# Altium schematic sheet 16.40PIN CONNECT.SchDoc: CM3 IO
size 297 x 209 mm; Page Create Date: March  8, 1995; Page Number: 16; Page Size: A4; Comment: radxa_1010; Page Count: 20; RevCode: 1.36; Doc: 40PIN CONNECT; DsnPath: D:\WMS\黄工\[RC119]CM3_IO_V1.36\对外资料\radxa_cm3_io_board_v1360.DSN; SchematicName: CM3_IO V1.36; PageName: 16.40PIN CONNECT; PageSize: A4; TopSchematic: True
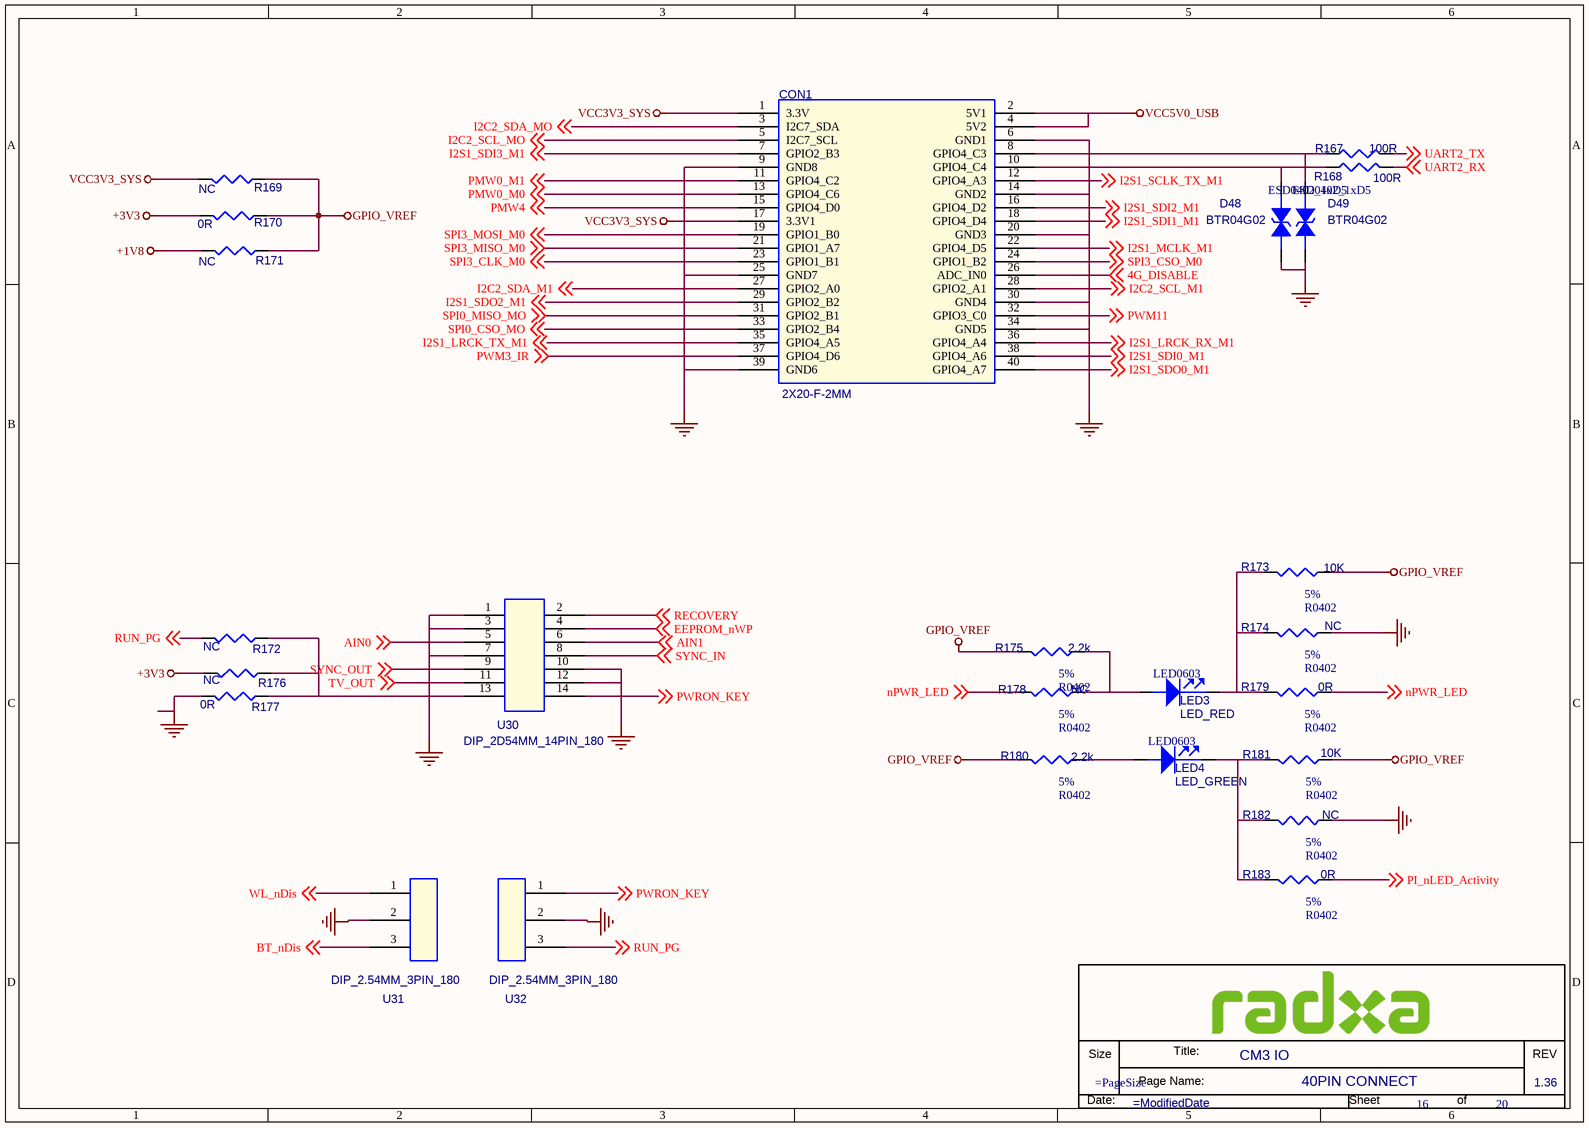
[diagram p0: 16.40PIN CONNECT.SchDoc]

## Parts
*  Doc: 40PIN CONNECT  RevCode: 1.36  Title: CM3 IO  Page Number: 16  Page Count: 20  (hidden comment: radxa_1010)  (graphical)
CON1  2X20-F-2MM  [DIP40PIN_2D54MM]
D48  BTR04G02  [ESD0402_1xD5]
D49  BTR04G02  [ESD0402_1xD5]
LED3  LED_RED  [LED0603]
LED4  LED_GREEN  [LED0603]
R167  100R  [R0402]
R168  100R  [R0402]
R169  NC  [R0603]
R170  0R  [R0603]
R171  NC  [R0603]
R172  NC  [R0402]
R173  10K  Tolerance: 5%  [R0402]
R174  NC  Tolerance: 5%  [R0402]
R175  2.2k  Tolerance: 5%  [R0402]
R176  NC  [R0402]
R177  0R  [R0402]
R178  NC  Tolerance: 5%  [R0402]
R179  0R  Tolerance: 5%  [R0402]
R180  2.2k  Tolerance: 5%  [R0402]
R181  10K  Tolerance: 5%  [R0402]
R182  NC  Tolerance: 5%  [R0402]
R183  0R  Tolerance: 5%  [R0402]
U30  DIP_2D54MM_14PIN_180  [DIP_14PIN-2_54MM]
U31  DIP_2.54MM_3PIN_180  [DIP3_1X2P54]
U32  DIP_2.54MM_3PIN_180  [DIP3_1X2P54]

## Nets
+1V8: R171.2
+3V3: R170.2 R176.2
GND: CON1.6(GND1) CON1.9(GND8) CON1.14(GND2) CON1.20(GND3) CON1.25(GND7) CON1.30(GND4) CON1.34(GND5) CON1.39(GND6) D48.1 D49.1 R174.2 R177.2 R182.2 U30.1 U30.3 U30.7 U30.10 U30.12 U31.2 U32.2
GPIO_VREF: R169.1 R170.1 R171.1 R173.2 R175.1 R180.1 R181.2
VCC3V3_SYS: CON1.1(3.3V) CON1.17(3.3V1) R169.2
VCC5V0_USB: CON1.2(5V1) CON1.4(5V2)
4G_DISABLE: CON1.26(ADC_IN0) ; off-sheet 4G_DISABLE
AIN0: U30.5 ; off-sheet AIN0
AIN1: U30.6 ; off-sheet AIN1
BT_nDis: U31.3 ; off-sheet BT_nDis
EEPROM_nWP: U30.4 ; off-sheet EEPROM_nWP
I2C2_SCL_M1: CON1.28(GPIO2_A1) ; off-sheet I2C2_SCL_M1
I2C2_SCL_MO: CON1.5(I2C7_SCL) ; off-sheet I2C2_SCL_MO
I2C2_SDA_M1: CON1.27(GPIO2_A0) ; off-sheet I2C2_SDA_M1
I2C2_SDA_MO: CON1.3(I2C7_SDA) ; off-sheet I2C2_SDA_MO
I2S1_LRCK_RX_M1: CON1.36(GPIO4_A4) ; off-sheet I2S1_LRCK_RX_M1
I2S1_LRCK_TX_M1: CON1.35(GPIO4_A5) ; off-sheet I2S1_LRCK_TX_M1
I2S1_MCLK_M1: CON1.22(GPIO4_D5) ; off-sheet I2S1_MCLK_M1
I2S1_SCLK_TX_M1: CON1.12(GPIO4_A3) ; off-sheet I2S1_SCLK_TX_M1
I2S1_SDI0_M1: CON1.38(GPIO4_A6) ; off-sheet I2S1_SDI0_M1
I2S1_SDI1_M1: CON1.18(GPIO4_D4) ; off-sheet I2S1_SDI1_M1
I2S1_SDI2_M1: CON1.16(GPIO4_D2) ; off-sheet I2S1_SDI2_M1
I2S1_SDI3_M1: CON1.7(GPIO2_B3) ; off-sheet I2S1_SDI3_M1
I2S1_SDO0_M1: CON1.40(GPIO4_A7) ; off-sheet I2S1_SDO0_M1
I2S1_SDO2_M1: CON1.29(GPIO2_B2) ; off-sheet I2S1_SDO2_M1
nPWR_LED: R178.1 R179.2 ; off-sheet nPWR_LED
PI_nLED_Activity: R183.2 ; off-sheet PI_nLED_Activity
PMW0_M0: CON1.13(GPIO4_C6) ; off-sheet PMW0_M0
PMW0_M1: CON1.11(GPIO4_C2) ; off-sheet PMW0_M1
PMW4: CON1.15(GPIO4_D0) ; off-sheet PMW4
PWM3_IR: CON1.37(GPIO4_D6) ; off-sheet PWM3_IR
PWM11: CON1.32(GPIO3_C0) ; off-sheet PWM11
PWRON_KEY: U30.14 U32.1 ; off-sheet PWRON_KEY
RECOVERY: U30.2 ; off-sheet RECOVERY
RUN_PG: R172.2 U32.3 ; off-sheet RUN_PG
SPI0_CSO_MO: CON1.33(GPIO2_B4) ; off-sheet SPI0_CSO_MO
SPI0_MISO_MO: CON1.31(GPIO2_B1) ; off-sheet SPI0_MISO_MO
SPI3_CLK_M0: CON1.23(GPIO1_B1) ; off-sheet SPI3_CLK_M0
SPI3_CSO_M0: CON1.24(GPIO1_B2) ; off-sheet SPI3_CSO_M0
SPI3_MISO_M0: CON1.21(GPIO1_A7) ; off-sheet SPI3_MISO_M0
SPI3_MOSI_M0: CON1.19(GPIO1_B0) ; off-sheet SPI3_MOSI_M0
SYNC_IN: U30.8 ; off-sheet SYNC_IN
SYNC_OUT: U30.9 ; off-sheet SYNC_OUT
TV_OUT: U30.11 ; off-sheet TV_OUT
UART2_RX: R168.2 ; off-sheet UART2_RX
UART2_TX: R167.2 ; off-sheet UART2_TX
WL_nDis: U31.1 ; off-sheet WL_nDis
NetCON1_8: CON1.8(GPIO4_C3) D49.2 R167.1
NetCON1_10: CON1.10(GPIO4_C4) D48.2 R168.1
NetLED3_1: LED3.1(ANODE) R175.2 R178.2
NetLED3_2: LED3.2(CATHODE) R173.1 R174.1 R179.1
NetLED4_1: LED4.1(ANODE) R180.2
NetLED4_2: LED4.2(CATHODE) R181.1 R182.1 R183.1
NetR172_1: R172.1 R176.1 R177.1 U30.13

## Notes on the sheet
- (in symbol radxa_1010) Size; Title:; REV; Page Name:; Date:; Sheet; of

## Library data of the parts
CON1 = CN_0: Part Reference: CON1; Value: 2X20-F-2MM; PCB Footprint: DIP40PIN_2D54MM
D48 = DIODE BI_DIR TRIG_0: 1-Line, Bi-directional, Transient Voltage Suppressors.17.5pF.; Part Reference: D48; Manufacturer PN: ESD5451N; Manufacturer: WillSemi(韦尔半导体); OPTION: DNP; Priority: A; PCB Footprint: ESD0402_1xD5; Value: BTR04G02; Created by: JJJ; Part Type: ESD_TVS; RK PN: ESD5451N
D49 = DIODE BI_DIR TRIG_0: 1-Line, Bi-directional, Transient Voltage Suppressors.17.5pF.; Part Reference: D49; Manufacturer: WillSemi(韦尔半导体); RK PN: ESD5451N; Priority: A; OPTION: DNP; PCB Footprint: ESD0402_1xD5; Value: BTR04G02; Part Type: ESD_TVS; Manufacturer PN: ESD5451N; Created by: JJJ
LED3 = LED: 贴片LED灯，0603，绿色; Part Reference: LED3; Priority: A; RK PN: LED_GREEN; PCB Footprint: LED0603; Value: LED_RED; Created by: JJJ; Part Type: LED
LED4 = LED: 贴片LED灯，0603，绿色; Part Reference: LED4; Priority: A; PCB Footprint: LED0603; Value: LED_GREEN; Created by: JJJ; Part Type: LED; RK PN: LED_GREEN
R167 = RESISTOR_0: 通用厚膜电阻,100R,+/-5%,R0402,1/16W.; Part Reference: R167; Manufacturer PN: RC0402JR-07100RL; Manufacturer: YAGEO; Wattage: 1/16W; Tolerance: 5%; Priority: A; Value: 100R; Created by: YTL; Part Type: 通用厚膜电阻; RK PN: RC0402JR-07100RL; PCB Footprint: R0402
R168 = RESISTOR_0: 通用厚膜电阻,100R,+/-5%,R0402,1/16W.; Part Reference: R168; Manufacturer: YAGEO; RK PN: RC0402JR-07100RL; Priority: A; Tolerance: 5%; Wattage: 1/16W; Value: 100R; Part Type: 通用厚膜电阻; Manufacturer PN: RC0402JR-07100RL; Created by: YTL; PCB Footprint: R0402
R169 = RESISTOR_0: 通用厚膜电阻,100R,+/-5%,R0402,1/16W.; Part Reference: R169; Manufacturer PN: RC0402JR-07100RL; Manufacturer: YAGEO; Wattage: 1/16W; Tolerance: 5%; Priority: A; Value: NC; Created by: YTL; Part Type: 通用厚膜电阻; RK PN: RC0402JR-07100RL; PCB Footprint: R0603
R170 = RESISTOR_0: 通用厚膜电阻,100R,+/-5%,R0402,1/16W.; Part Reference: R170; Manufacturer: YAGEO; RK PN: RC0402JR-07100RL; Priority: A; Tolerance: 5%; Wattage: 1/16W; Value: 0R; Part Type: 通用厚膜电阻; Manufacturer PN: RC0402JR-07100RL; Created by: YTL; PCB Footprint: R0603
R171 = RESISTOR_0: 通用厚膜电阻,100R,+/-5%,R0402,1/16W.; Part Reference: R171; Manufacturer PN: RC0402JR-07100RL; Manufacturer: YAGEO; Wattage: 1/16W; Tolerance: 5%; Priority: A; Value: NC; Created by: YTL; Part Type: 通用厚膜电阻; RK PN: RC0402JR-07100RL; PCB Footprint: R0603
R172 = RESISTOR_0: 通用厚膜电阻,100R,+/-5%,R0402,1/16W.; Part Reference: R172; Manufacturer PN: RC0402JR-07100RL; Manufacturer: YAGEO; Wattage: 1/16W; Tolerance: 5%; Priority: A; Value: NC; Created by: YTL; Part Type: 通用厚膜电阻; RK PN: RC0402JR-07100RL; PCB Footprint: R0402
R173 = RESISTOR_2: 通用厚膜电阻,330R,+/-5%,R0402,1/16W.; Part Reference: R173; Manufacturer PN: RC0402JR-07330RL; Manufacturer: YAGEO; Wattage: 1/16W; Priority: A; PCB Footprint: R0402; Value: 10K; Created by: YTL; Part Type: 通用厚膜电阻; RK PN: RC0402JR-07330RL
R174 = RESISTOR_2: 通用厚膜电阻,330R,+/-5%,R0402,1/16W.; Part Reference: R174; Manufacturer: YAGEO; RK PN: RC0402JR-07330RL; Priority: A; Wattage: 1/16W; PCB Footprint: R0402; Value: NC; Part Type: 通用厚膜电阻; Manufacturer PN: RC0402JR-07330RL; Created by: YTL
R175 = RESISTOR_2: 通用厚膜电阻,330R,+/-5%,R0402,1/16W.; Part Reference: R175; Manufacturer: YAGEO; RK PN: RC0402JR-07330RL; Priority: A; Wattage: 1/16W; PCB Footprint: R0402; Value: 2.2k; Part Type: 通用厚膜电阻; Manufacturer PN: RC0402JR-07330RL; Created by: YTL
R176 = RESISTOR_0: 通用厚膜电阻,100R,+/-5%,R0402,1/16W.; Part Reference: R176; Manufacturer: YAGEO; RK PN: RC0402JR-07100RL; Priority: A; Tolerance: 5%; Wattage: 1/16W; Value: NC; Part Type: 通用厚膜电阻; Manufacturer PN: RC0402JR-07100RL; Created by: YTL; PCB Footprint: R0402
R177 = RESISTOR_0: 通用厚膜电阻,100R,+/-5%,R0402,1/16W.; Part Reference: R177; Manufacturer PN: RC0402JR-07100RL; Manufacturer: YAGEO; Wattage: 1/16W; Tolerance: 5%; Priority: A; Value: 0R; Created by: YTL; Part Type: 通用厚膜电阻; RK PN: RC0402JR-07100RL; PCB Footprint: R0402
R178 = RESISTOR_2: 通用厚膜电阻,330R,+/-5%,R0402,1/16W.; Part Reference: R178; Manufacturer: YAGEO; RK PN: RC0402JR-07330RL; Priority: A; Wattage: 1/16W; PCB Footprint: R0402; Value: NC; Part Type: 通用厚膜电阻; Manufacturer PN: RC0402JR-07330RL; Created by: YTL
R179 = RESISTOR_2: 通用厚膜电阻,330R,+/-5%,R0402,1/16W.; Part Reference: R179; Manufacturer: YAGEO; RK PN: RC0402JR-07330RL; Priority: A; Wattage: 1/16W; PCB Footprint: R0402; Value: 0R; Part Type: 通用厚膜电阻; Manufacturer PN: RC0402JR-07330RL; Created by: YTL
R180 = RESISTOR_2: 通用厚膜电阻,330R,+/-5%,R0402,1/16W.; Part Reference: R180; Manufacturer PN: RC0402JR-07330RL; Manufacturer: YAGEO; Wattage: 1/16W; Priority: A; PCB Footprint: R0402; Value: 2.2k; Created by: YTL; Part Type: 通用厚膜电阻; RK PN: RC0402JR-07330RL
R181 = RESISTOR_2: 通用厚膜电阻,330R,+/-5%,R0402,1/16W.; Part Reference: R181; Manufacturer PN: RC0402JR-07330RL; Manufacturer: YAGEO; Wattage: 1/16W; Priority: A; PCB Footprint: R0402; Value: 10K; Created by: YTL; Part Type: 通用厚膜电阻; RK PN: RC0402JR-07330RL
R182 = RESISTOR_2: 通用厚膜电阻,330R,+/-5%,R0402,1/16W.; Part Reference: R182; Manufacturer: YAGEO; RK PN: RC0402JR-07330RL; Priority: A; Wattage: 1/16W; PCB Footprint: R0402; Value: NC; Part Type: 通用厚膜电阻; Manufacturer PN: RC0402JR-07330RL; Created by: YTL
R183 = RESISTOR_2: 通用厚膜电阻,330R,+/-5%,R0402,1/16W.; Part Reference: R183; Manufacturer: YAGEO; RK PN: RC0402JR-07330RL; Priority: A; Wattage: 1/16W; PCB Footprint: R0402; Value: 0R; Part Type: 通用厚膜电阻; Manufacturer PN: RC0402JR-07330RL; Created by: YTL
U30 = CON3_0: Part Reference: U30; Value: DIP_2D54MM_14PIN_180; PCB Footprint: DIP_14PIN-2_54MM
U31 = CON3_1: Part Reference: U31; Value: DIP_2.54MM_3PIN_180; PCB Footprint: DIP3_1X2P54
U32 = CON3_1: Part Reference: U32; Value: DIP_2.54MM_3PIN_180; PCB Footprint: DIP3_1X2P54
* = radxa_1010: Page Create Date: March  8, 1995; Page Size: =PageSize; Page Modify Date: =ModifiedDate